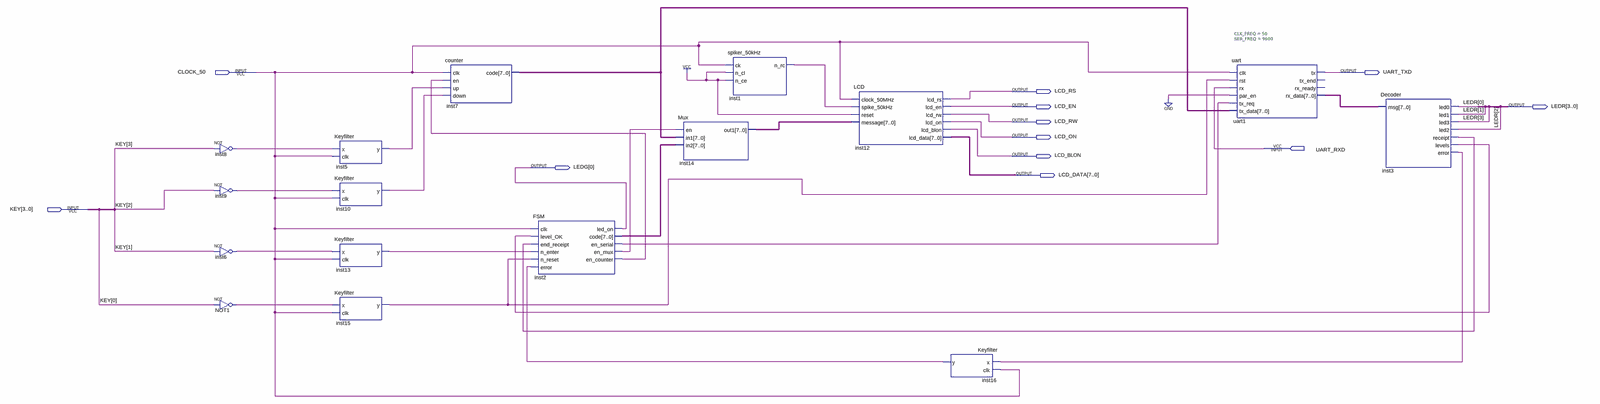
[diagram p0: schematic sheet, whole]
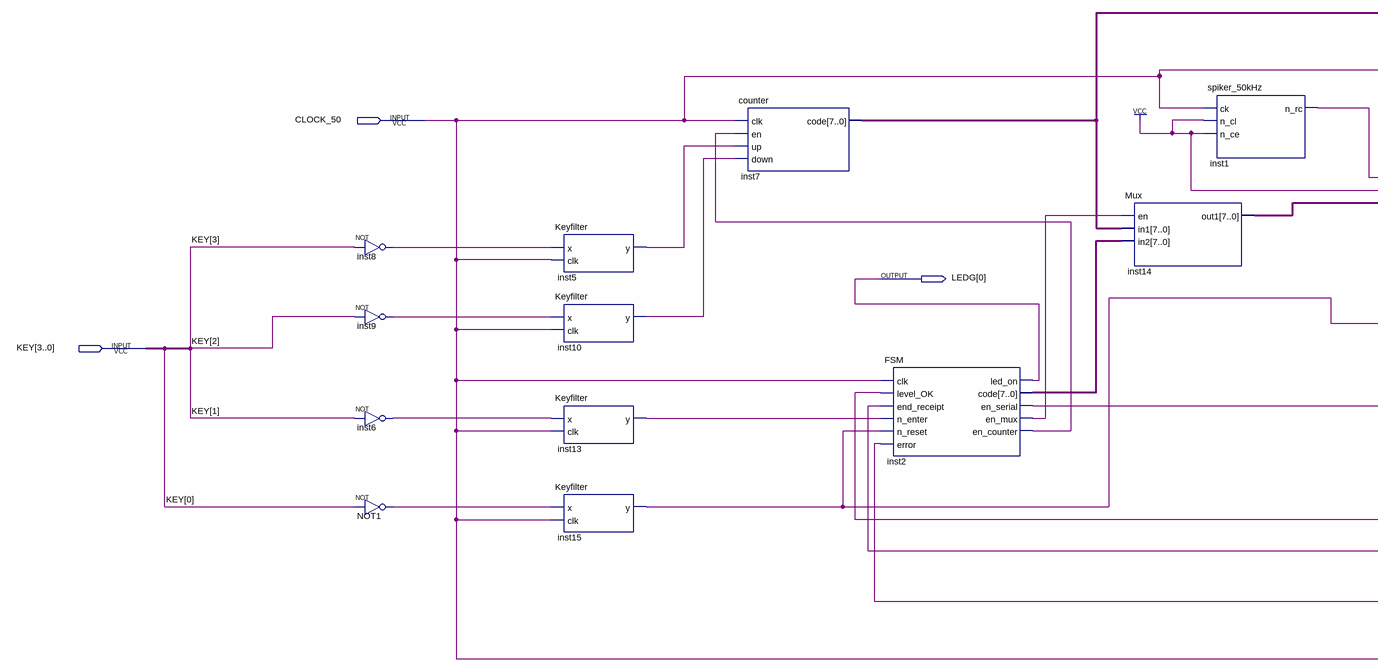
[diagram p1: schematic sheet, left part]
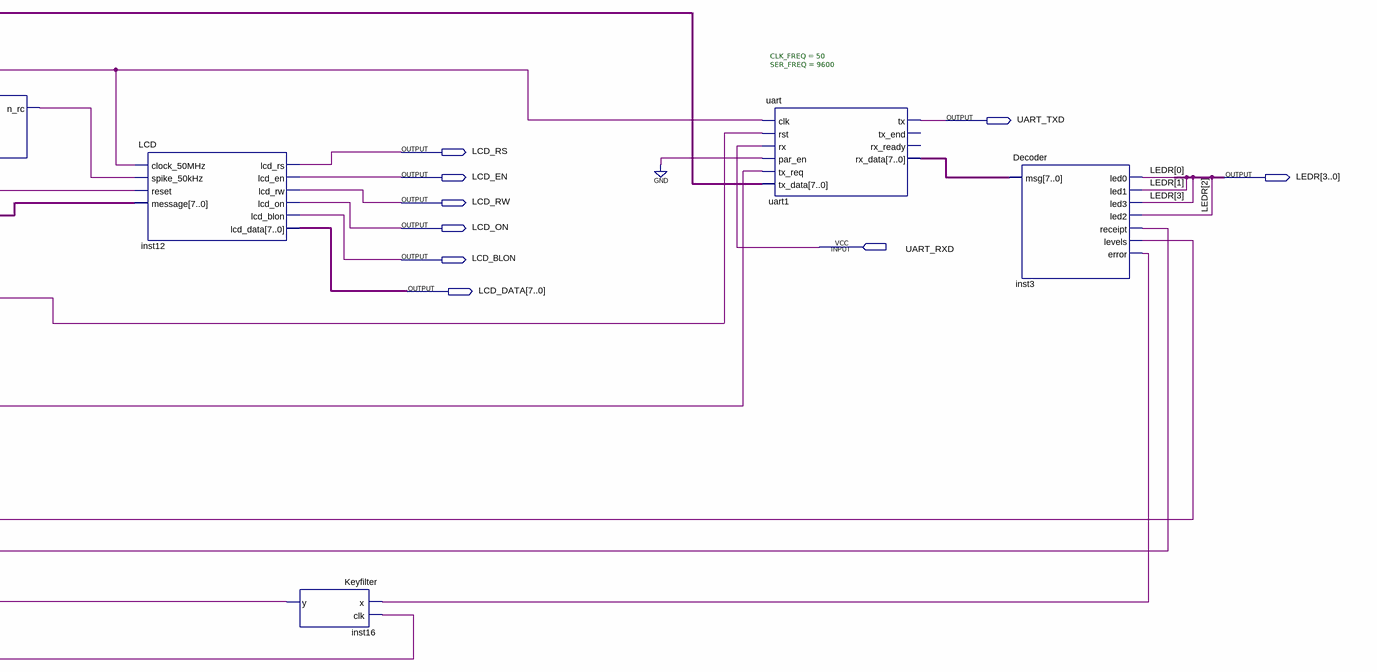
[diagram p2: schematic sheet, right part]
// Quartus schematic MADs.bdf as structural Verilog: 16 symbols, 12 pins
module MADs (
  input  CLOCK_50,
  input  UART_RXD,
  input  [3:0] KEY,
  output UART_TXD,
  output LCD_RS,
  output LCD_EN,
  output [3:0] LEDR,
  output LCD_RW,
  output LCD_ON,
  output LCD_BLON,
  output [0:0] LEDG,
  output [7:0] LCD_DATA
);

  wire inst1_n_rc, inst2_en_counter, inst2_en_mux, inst2_en_serial, inst3_error, inst3_levels, inst3_receipt,
       inst5_y, inst6_out, inst8_out, inst9_out, inst10_y, inst13_y, inst15_y, inst16_y, NOT1_out;
  wire [7:0] inst2_code, inst7_code, inst14_out1, uart1_rx_data;

  not inst8 (inst8_out, KEY[3]);
  not inst9 (inst9_out, KEY[2]);
  not inst6 (inst6_out, KEY[1]);
  not NOT1 (NOT1_out, KEY[0]);
  Keyfilter inst5 (.x(inst8_out), .clk(CLOCK_50), .y(inst5_y));
  Keyfilter inst10 (.x(inst9_out), .clk(CLOCK_50), .y(inst10_y));
  Keyfilter inst13 (.x(inst6_out), .clk(CLOCK_50), .y(inst13_y));
  Keyfilter inst15 (.x(NOT1_out), .clk(CLOCK_50), .y(inst15_y));
  counter inst7 (.clk(CLOCK_50), .en(inst2_en_counter), .up(inst5_y), .down(inst10_y), .code(inst7_code));
  FSM inst2 (
    .clk(CLOCK_50), .level_OK(inst3_levels), .end_receipt(inst3_receipt), .n_enter(inst13_y),
    .n_reset(inst15_y), .error(inst16_y), .led_on(LEDG[0]), .code(inst2_code), .en_serial(inst2_en_serial),
    .en_mux(inst2_en_mux), .en_counter(inst2_en_counter));
  Mux inst14 (.en(inst2_en_mux), .in1(inst7_code), .in2(inst2_code), .out1(inst14_out1));
  spiker_50kHz inst1 (.ck(CLOCK_50), .n_cl(1'b1), .n_ce(1'b1), .n_rc(inst1_n_rc));
  LCD inst12 (
    .clock_50MHz(CLOCK_50), .spike_50kHz(inst1_n_rc), .reset(1'b1), .message(inst14_out1), .lcd_rs(LCD_RS),
    .lcd_en(LCD_EN), .lcd_rw(LCD_RW), .lcd_on(LCD_ON), .lcd_blon(LCD_BLON), .lcd_data(LCD_DATA));
  Keyfilter inst16 (.x(inst3_error), .clk(CLOCK_50), .y(inst16_y));
  uart #(.CLK_FREQ(50), .SER_FREQ(9600)) uart1 (
    .clk(CLOCK_50), .rst(inst15_y), .rx(UART_RXD), .par_en(1'b0), .tx_req(inst2_en_serial),
    .tx_data(inst7_code), .tx(UART_TXD), .rx_data(uart1_rx_data));  // open: tx_end, rx_ready
  Decoder inst3 (
    .msg(uart1_rx_data), .led0(LEDR[0]), .led1(LEDR[1]), .led3(LEDR[3]), .led2(LEDR[2]),
    .receipt(inst3_receipt), .levels(inst3_levels), .error(inst3_error));
endmodule
